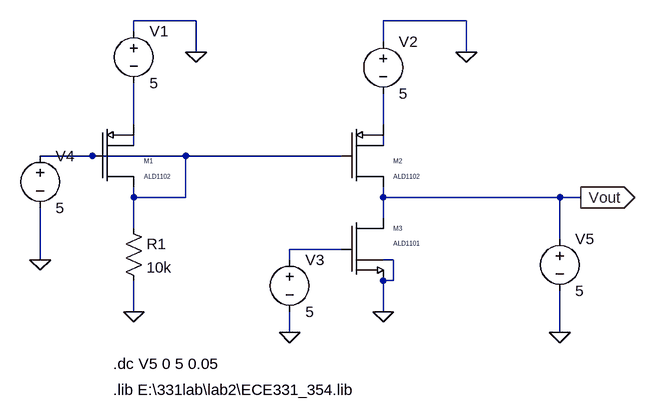
[diagram p0: schematic lab3_2.asc]
lab3_2.asc, the LTspice schematic file:
Version 4
SHEET 1 920 680
WIRE 208 -48 112 -48
WIRE 624 -48 496 -48
WIRE 112 -32 112 -48
WIRE 496 -16 496 -48
WIRE 208 0 208 -48
WIRE 624 0 624 -48
WIRE 112 112 112 48
WIRE 496 112 496 64
WIRE 112 144 112 128
WIRE 496 144 496 128
WIRE 48 160 -32 160
WIRE 192 160 48 160
WIRE 432 160 192 160
WIRE 112 224 112 208
WIRE 192 224 192 160
WIRE 192 224 112 224
WIRE 496 224 496 208
WIRE 768 224 496 224
WIRE 800 224 768 224
WIRE 496 256 496 224
WIRE 112 272 112 224
WIRE 768 288 768 224
WIRE 432 304 352 304
WIRE -32 320 -32 240
WIRE 352 320 352 304
WIRE 512 320 496 320
WIRE 512 352 512 320
WIRE 512 352 496 352
WIRE 112 400 112 352
WIRE 496 400 496 352
WIRE 352 432 352 400
WIRE 768 432 768 368
FLAG 624 0 0
FLAG 208 0 0
FLAG 112 400 0
FLAG 496 400 0
FLAG 352 432 0
FLAG -32 320 0
FLAG 768 432 0
FLAG 800 224 Vout
IOPIN 800 224 Out
SYMBOL ALD1102 48 112 R0
SYMATTR InstName M1
SYMBOL ALD1102 432 112 R0
SYMATTR InstName M2
SYMBOL voltage 112 -48 R0
WINDOW 123 0 0 Left 2
WINDOW 39 0 0 Left 2
SYMATTR InstName V1
SYMATTR Value 5
SYMBOL voltage 496 -32 R0
WINDOW 123 0 0 Left 2
WINDOW 39 0 0 Left 2
SYMATTR InstName V2
SYMATTR Value 5
SYMBOL res 96 256 R0
SYMATTR InstName R1
SYMATTR Value 10k
SYMBOL ALD1101 432 256 R0
SYMATTR InstName M3
SYMBOL voltage 352 304 R0
WINDOW 123 0 0 Left 2
WINDOW 39 0 0 Left 2
SYMATTR InstName V3
SYMATTR Value 5
SYMBOL voltage -32 144 R0
WINDOW 123 0 0 Left 2
WINDOW 39 0 0 Left 2
SYMATTR InstName V4
SYMATTR Value 5
SYMBOL voltage 768 272 R0
WINDOW 123 0 0 Left 2
WINDOW 39 0 0 Left 2
SYMATTR InstName V5
SYMATTR Value 5
TEXT 80 520 Left 2 !.lib E:\\331lab\\lab2\\ECE331_354.lib
TEXT 80 480 Left 2 !.dc V5 0 5 0.05

The netlist it stands for:
* lab3_2.asc
M1 N005 N005 N001 N003 ALD1102 W=1.739e-3 L=1e-6
M2 Vout N005 N002 N004 ALD1102 W=1.739e-3 L=1e-6
V1 0 N001 5
V2 0 N002 5
R1 N005 0 10k
M3 Vout N006 0 0 ALD1101 W=1.379e-3 L=1E-6
V3 N006 0 5
V4 N005 0 5
V5 Vout 0 5
.model NMOS NMOS
.model PMOS PMOS
.lib standard.mos
.lib E:\331lab\lab2\ECE331_354.lib
.dc V5 0 5 0.05
.backanno
.end